# Altium project ELS_CONTROL.PrjPcb
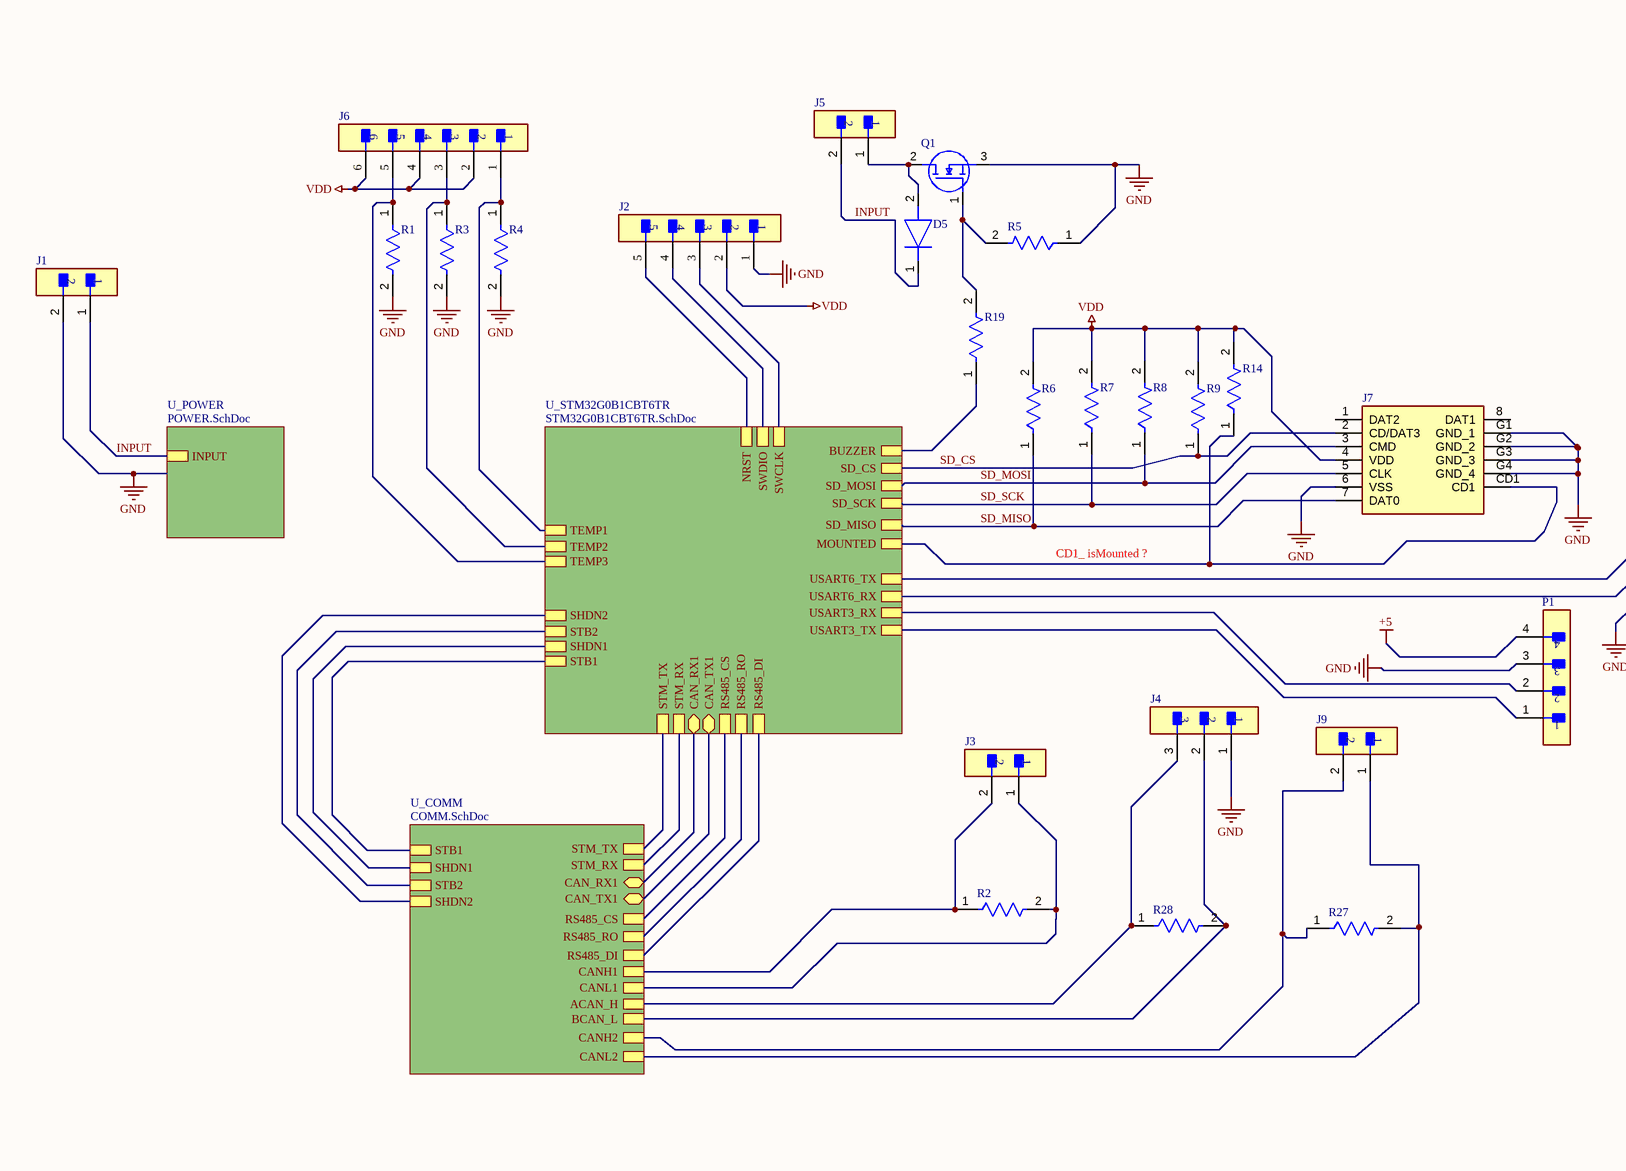
[diagram p0: MAIN.SchDoc, left]
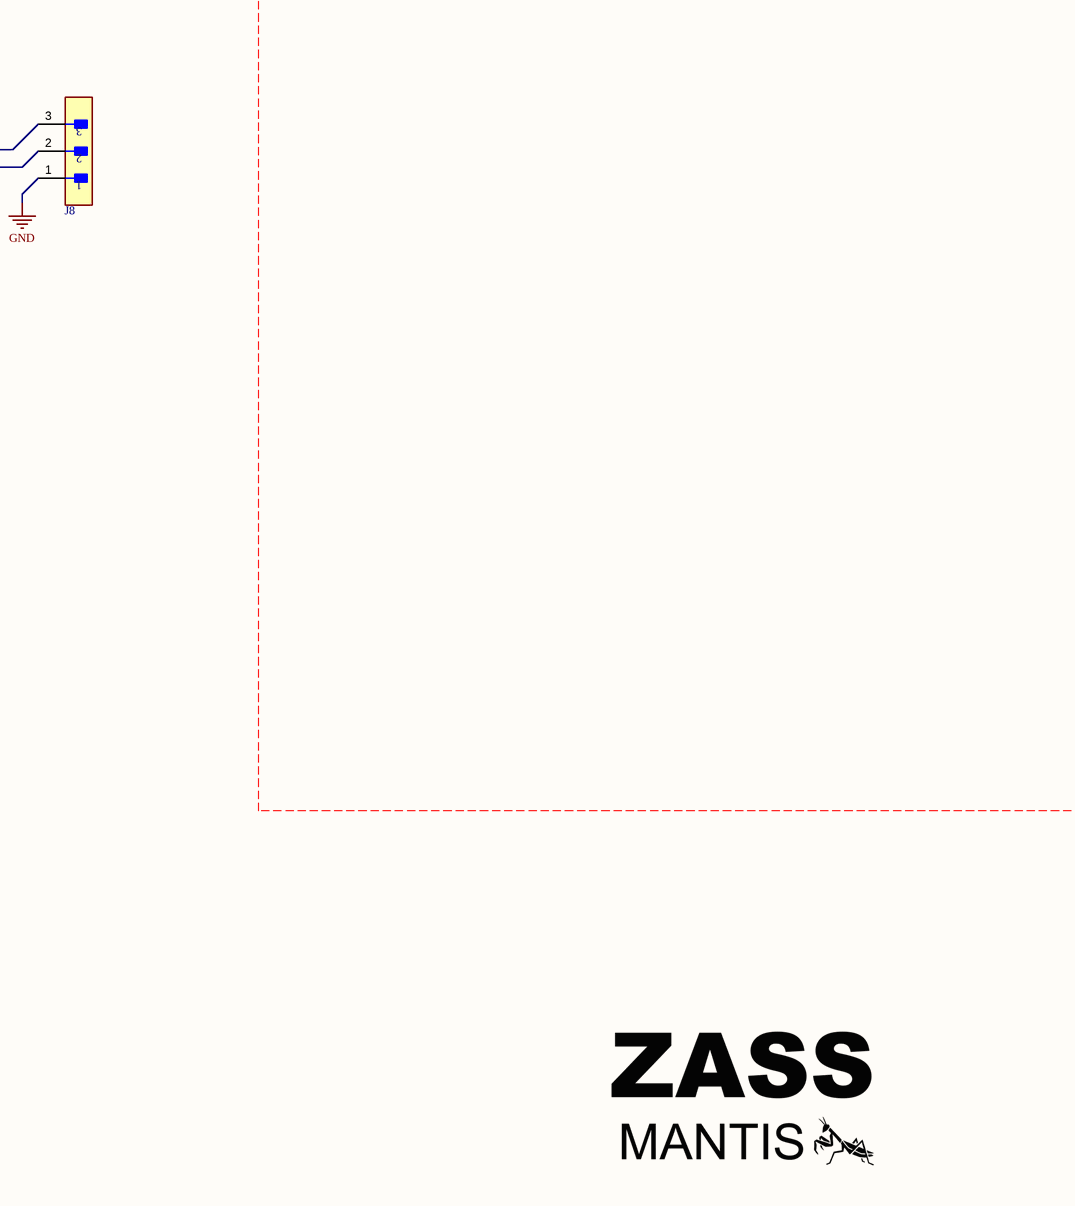
[diagram p1: MAIN.SchDoc, right]
4 sheets, 61 parts. Net scope: hierarchical (ports join the sheet entries above them; power ports are global).
Board files: PCB2.PcbDoc, PCB1.PcbDoc
Sheets:
  MAIN.SchDoc
    U_STM32G0B1CBT6TR = STM32G0B1CBT6TR.SchDoc
    U_POWER = POWER.SchDoc
    U_COMM = COMM.SchDoc

## Sheet MAIN.SchDoc
size 594 x 420 mm; SheetNumber: 1; SheetTotal: 4

### Parts
D5  1N4007WS  [SOD2613X110N]  (value not drawn)
J1  B2B-XH-A(LF)(SN)  [FP-B2B-XH-A_LF_SN-MFG]  (value not drawn)
J2  B5B-XH-AM(LF)(SN)  [FP-B5B-XH-AM_LF_SN-MFG]  (value not drawn)
J3  B2B-XH-A(LF)(SN)  [FP-B2B-XH-A_LF_SN-MFG]  (value not drawn)
J4  B3B-XH-A(LF)(SN)  [FP-B3B-XH-A_LF_SN-MFG]  (value not drawn)
J5  S2B-XH-A(LF)(SN)  [FP-B2B-XH-A_LF_SN-MFG]  (value not drawn)
J6  B6B-XH-AM(LF)(SN)  [FP-B6B-XH-AM_LF_SN-MFG]  (value not drawn)
J7  MSD-4-A  [MSD4A]  (value not drawn)
J8  B3B-XH-A(LF)(SN)  [FP-B3B-XH-A_LF_SN-MFG]  (value not drawn)
J9  B2B-XH-A(LF)(SN)  [FP-B2B-XH-A_LF_SN-MFG]  (value not drawn)
P1  B4B-XH-A(LF)(SN)  [FP-B4B-XH-A_LF_SN-MFG]  (value not drawn)
Q1  AO3422  [SOT95P237X112-3N]  (value not drawn)
R1  CRGCQ0603J10K  [FP-CRGCQ0603-IPC_C]  (value not drawn)
R2  CRGCQ0603F120R  [FP-CRGCQ0603-IPC_C]  (value not drawn)
R3  CRGCQ0603J10K  [FP-CRGCQ0603-IPC_C]  (value not drawn)
R4  CRGCQ0603J10K  [FP-CRGCQ0603-IPC_C]  (value not drawn)
R5  CRGCQ0603J10K  [FP-CRGCQ0603-IPC_C]  (value not drawn)
R6  CRCW06034K70FKEA  [FP-CRCW0603-e3-IPC_A]  (value not drawn)
R7  CRCW06034K70FKEA  [FP-CRCW0603-e3-IPC_A]  (value not drawn)
R8  CRCW06034K70FKEA  [FP-CRCW0603-e3-IPC_A]  (value not drawn)
R9  CRCW06034K70FKEA  [FP-CRCW0603-e3-IPC_A]  (value not drawn)
R14  CRCW06034K70FKEA  [FP-CRCW0603-e3-IPC_A]  (value not drawn)
R19  CRGCQ0603F1K2  [FP-CRGCQ0603-IPC_C]  (value not drawn)
R27  CRGCQ0603F120R  [FP-CRGCQ0603-IPC_C]  (value not drawn)
R28  CRGCQ0603F120R  [FP-CRGCQ0603-IPC_C]  (value not drawn)

### Sub-sheets
U_COMM = COMM.SchDoc: CAN_TX1 (bidir), CAN_RX1 (bidir), ACAN_H, BCAN_L, STM_RX, STM_TX, RS485_CS, CANH1, CANL1, STB1, SHDN1, STB2, SHDN2, CANL2, CANH2, RS485_DI, RS485_RO
U_POWER = POWER.SchDoc: INPUT
U_STM32G0B1CBT6TR = STM32G0B1CBT6TR.SchDoc: CAN_RX1 (bidir), CAN_TX1 (bidir), STM_TX, STM_RX, USART3_RX, USART3_TX, TEMP1, TEMP2, TEMP3, SD_CS, SD_SCK, SD_MISO, SD_MOSI, BUZZER, RS485_CS, NRST, SWCLK, SWDIO, STB1, SHDN1, STB2, SHDN2, MOUNTED, RS485_DI, RS485_RO, USART6_RX, USART6_TX

### Nets
+5: P1.4
GND: J1.2 J2.1 J4.1 J7.6(VSS) J7.G1(GND_1) J7.G2(GND_2) J7.G3(GND_3) J7.G4(GND_4) J8.1 P1.3 Q1.3(S) R1.2 R3.2 R4.2 R5.1
VDD: J2.2 J6.2 J6.4 J6.6 J7.4(VDD) R6.2 R7.2 R8.2 R9.2 R14.2
ACAN_H: J4.3 R28.1 ; sheet U_COMM/ACAN_H
BCAN_L: J4.2 R28.2 ; sheet U_COMM/BCAN_L
INPUT: D5.1(K) J1.1 J5.2 ; sheet U_POWER/INPUT
NRST: J2.5 J6.1 R4.1 ; sheet U_STM32G0B1CBT6TR/TEMP1, sheet U_STM32G0B1CBT6TR/NRST
SD_CS: J7.2(CD/DAT3) R9.1 ; sheet U_STM32G0B1CBT6TR/SD_CS
SD_MISO: J7.7(DAT0) R6.1 ; sheet U_STM32G0B1CBT6TR/SD_MISO
SD_MOSI: J7.3(CMD) R8.1 ; sheet U_STM32G0B1CBT6TR/SD_MOSI
SD_SCK: J7.5(CLK) R7.1 ; sheet U_STM32G0B1CBT6TR/SD_SCK
SHDN1: sheet U_STM32G0B1CBT6TR/SHDN1, sheet U_COMM/SHDN1
SHDN2: sheet U_STM32G0B1CBT6TR/SHDN2, sheet U_COMM/SHDN2
STB1: sheet U_STM32G0B1CBT6TR/STB1, sheet U_COMM/STB1
STB2: sheet U_STM32G0B1CBT6TR/STB2, sheet U_COMM/STB2
SWCLK: J2.3 ; sheet U_STM32G0B1CBT6TR/SWCLK
SWDIO: J2.4 ; sheet U_STM32G0B1CBT6TR/SWDIO
NetD2_1: J3.2 R2.1 ; sheet U_COMM/CANH1
NetD2_2: J3.1 R2.2 ; sheet U_COMM/CANL1
NetD4_1: J9.2 R27.1 ; sheet U_COMM/CANH2
NetD4_2: J9.1 R27.2 ; sheet U_COMM/CANL2
NetD5_2: D5.2(A) J5.1 Q1.2(D)
NetIC1_12: J6.3 R3.1 ; sheet U_STM32G0B1CBT6TR/TEMP2
NetIC1_13: J6.5 R1.1 ; sheet U_STM32G0B1CBT6TR/TEMP3
NetIC1_14: J7.CD1 R14.1 ; sheet U_STM32G0B1CBT6TR/MOUNTED
NetIC1_19: sheet U_STM32G0B1CBT6TR/STM_RX, sheet U_COMM/STM_RX
NetIC1_20: sheet U_STM32G0B1CBT6TR/STM_TX, sheet U_COMM/STM_TX
NetIC1_22: P1.1 ; sheet U_STM32G0B1CBT6TR/USART3_TX
NetIC1_23: P1.2 ; sheet U_STM32G0B1CBT6TR/USART3_RX
NetIC1_29: sheet U_STM32G0B1CBT6TR/RS485_CS, sheet U_COMM/RS485_CS
NetIC1_32: R19.1 ; sheet U_STM32G0B1CBT6TR/BUZZER
NetIC1_33: sheet U_STM32G0B1CBT6TR/CAN_RX1, sheet U_COMM/CAN_RX1
NetIC1_34: sheet U_STM32G0B1CBT6TR/CAN_TX1, sheet U_COMM/CAN_TX1
NetIC1_40: sheet U_STM32G0B1CBT6TR/RS485_DI, sheet U_COMM/RS485_DI
NetIC1_41: sheet U_STM32G0B1CBT6TR/RS485_RO, sheet U_COMM/RS485_RO
NetIC1_47: J8.2 ; sheet U_STM32G0B1CBT6TR/USART6_RX
NetIC1_48: J8.3 ; sheet U_STM32G0B1CBT6TR/USART6_TX
NetQ1_1: Q1.1(G) R5.2 R19.2

Not connected (* = marked no-connect by the designer): J7 1(DAT2) 8(DAT1)

### Notes on the sheet
- CD1_ isMounted ?
- DWG NO:
- REV:
- THIS DOCUMENT AND THE DATA DISCLOSED HEREIN OR
- HEREWITH IS THE PROPERTY OF ALTIUM LIMITED AND MAY
- BE FREELY DISTRIBUTED IN WHOLE. NO RIGHTS ARE
- RESERVED OR EXPRESS OR IMPLIED WARANTEE GIVEN.
- REVISION
- DESCRIPTION
- DATE
- APPROVED
- PROJECT
- PROJECT REVISION:
- TITLE
- A2
- SIZE
- FILE NAME
- SHEET
- OF

### Library data of the parts
D5 = 1N4007WS: Diode; Manufacturer_Name: MDD; Datasheet Link: https://datasheet.lcsc.com/szlcsc/MDD-Jiangsu-Yutai-Elec-1N4007WS_C193404.pdf; Height: 1.1mm; Manufacturer_Part_Number: 1N4007WS
J1 J3 J5 J9 = CMP-2000-05888-3: CONN HEADER VERT 2POS 2.5MM; Current Rating: 3A; Voltage Rating: 250V; Number of Contacts: 2; Contact Resistance: 20mR; Wire/Cable Gauge: 22AWG; Insulation Resistance: 1GR; Connector Type: Male Pin; Packaging: Bulk; Contact Material: Brass; Lead Free: Lead Free; Orientation: Straight; Contact Plating: Tin; Max Current Rating: 3A; Termination: Solder; Fastening Type: Detent; Depth: 5.75mm; Housing Material: Polyamide; REACH SVHC: No SVHC; Series: XH; Voltage Rating (AC): 250V; Number of Positions: 2; Color: Natural; Contact Type: Male Pin; Max Voltage Rating (DC): 250V; Pitch: 2.5mm; Lead Pitch: 2.5mm; Mount: Through Hole; Max Operating Temperature: 85°C; Length: 7.4mm; Max Voltage Rating (AC): 250V; Min Operating Temperature: -25°C; Number of Rows: 1; Housing Color: White
J2 = CMP-17439-000304-1: CONN HEADER VERT 5POS 2.5MM; Mated Stacking Heights: 9.8mm; Voltage Rating: 250V; Max Current Rating: 3A; Number of Positions: 5; Contact Resistance: 20mR; Depth: 5.75mm; Connector Type: Header; Color: Green; Insulation Material: Nylon; Contact Plating: Copper; Length: 14.9mm; Fastening Type: Detent; Contact Material: Brass; Number of Rows: 1; Contact Type: Male Pin; Housing Material: Polyamide; Housing Color: White; Lead Free: Lead Free; Max Voltage Rating (AC): 250V; Mount: Through Hole; Contact Shape: Square; Min Operating Temperature: -25°C; Packaging: Bulk; Orientation: Straight; Insulation Color: Natural; Series: XH; Flammability Rating: UL94 V-0; Contact Finish - Mating: TIN; Max Operating Temperature: 85°C; Termination: Solder; Pitch: 2.5mm
J4 J8 = CMP-17439-000014-3: CONN HEADER VERT 3POS 2.5MM; Max Voltage Rating (DC): 250V; Number of Positions: 3; Current Rating: 3A; Gender: Male; Wire/Cable Gauge: 22AWG; Contact Resistance: 20mR; Insulation Resistance: 1GR; Insulation Material: Nylon; Contact Plating: Tin; Depth: 5.75mm; Contact Type: Male Pin; Max Operating Temperature: 85°C; Insulation Color: Natural; Voltage Rating (AC): 250V; Color: Natural; Connector Type: Header; Orientation: Straight; Fastening Type: Detent; Housing Color: White; Min Operating Temperature: -25°C; Termination: Solder; Voltage Rating: 250V; Series: XH; Pitch: 2.5mm; Contact Shape: Square; Number of Rows: 1; Lead Free: Lead Free; Packaging: Bulk; Mount: Through Hole; Flammability Rating: UL94 V-0; Max Voltage Rating (AC): 250V; REACH SVHC: No SVHC; Housing Material: Polyamide; Contact Material: Brass; Lead Pitch: 2.5mm; Contact Finish - Mating: TIN; Length: 9.9mm; Max Current Rating: 3A; Number of Contacts: 3
J6 = CMP-17439-000167-1: CONN HEADER VERT 6POS 2.5MM; Shape: Straight; Current Rating: 3A; Mated Stacking Heights: 9.8mm; Number of Positions: 6; Voltage Rating: 250V; Pitch: 2.5mm; Insulation Color: Natural; Number of Pins: 6; Width: 5.75mm; Flammability Rating: UL94 V-0; Packaging: Bulk; Connector Type: Header; Number of Rows: 1; Contact Plating: Copper; Mount: Through Hole; Min Operating Temperature: -25°C; Contact Type: Male Pin; Contact Shape: Square; Fastening Type: Detent; Length: 17.4mm; Series: XH; Contact Finish - Mating: TIN; Max Operating Temperature: 85°C; Insulation Material: Nylon; Number of Poles: 6; Termination: Press-Fit; Contact Material: Brass; Height: 7mm
J7 = MSD-4-A: Connector; Manufacturer_Name: Same Sky; Datasheet Link: https://www.sameskydevices.com/product/resource/MSD-4-A.pdf; Height: 2mm; Manufacturer_Part_Number: MSD-4-A; Mouser Part Number: 179-MSD-4-A; Mouser Price/Stock: https://www.mouser.co.uk/ProductDetail/Same-Sky/MSD-4-A?qs=Z%252BL2brAPG1Jll%252BQTi%252Btupg%3D%3D; Arrow Part Number: MSD-4-A; Arrow Price/Stock: https://www.arrow.com/en/products/msd-4-a/cui-devices?utm_currency=USD&region=nac
P1 = CMP-17439-000250-1: CONN HEADER VERT 4POS 2.5MM; Number of Contacts: 4; Contact Resistance: 20mR; Voltage Rating: 250V; Max Current Rating: 3A; Gender: Male; Wire/Cable Gauge: 22AWG; Mated Stacking Heights: 9.8mm; Insulation Resistance: 1GR; Orientation: Straight; Contact Type: Male Pin; Contact Finish - Mating: TIN; Series: XH; Max Voltage Rating (AC): 250V; Lead Pitch: 2.5mm; Contact Shape: Square; Insulation Color: Natural; Termination: Solder; Lead Free: Lead Free; Voltage Rating (AC): 250V; Number of Rows: 1; Flammability Rating: UL94 V-0; Number of Positions: 4; Max Operating Temperature: 85°C; Package Quantity: 500; Mount: Through Hole; REACH SVHC: No SVHC; Connector Type: Header; Insulation Material: Nylon; Fastening Type: Detent; Min Operating Temperature: -25°C; Housing Color: White; Packaging: Bulk; Contact Plating: Tin; Contact Material: Brass; Max Voltage Rating (DC): 250V; Housing Material: Polyamide; Color: Natural; Material: Polyamide; Pitch: 2.5mm; Depth: 5.75mm; Current Rating: 3A; Length: 12.4mm
Q1 = AO3422: MOSFET (N-Channel); Manufacturer_Name: Alpha & Omega Semiconductors; Datasheet Link: http://aosmd.com/res/data_sheets/AO3422.pdf; Height: 1.12mm; Manufacturer_Part_Number: AO3422; Arrow Part Number: AO3422; Arrow Price/Stock: https://www.arrow.com/en/products/ao3422/alpha-and-omega-semiconductor?region=nac
R1 R3-R5 = CMP-03211-009884-1: CRGCQ 0603 10K 5%; Manufacturer: TE Connectivity; Tolerance: 0.05; Power Rating: 0.1W; Resistance: 10KΩ; Voltage Rating: 75V; Value: 10KΩ; Temperature Coefficient: ±100ppm/°C; Composition: Thick Film; ComponentLink2URL: https://www.te.com/commerce/DocumentDelivery/DDEController?Action=showdoc&DocId=Data+Sheet%7F1773204-3%7F1%7Fpdf%7FEnglish%7FENG_DS_1773204-3_1.pdf%7F4-2176339-923; Device Class L1: Passive Components; Package: CRGCQ0603; Mouser Description: Res Thick Film 0603 10K Ohm 5% 0.1W(1/10W) ±100ppm/C Pad SMD Automotive T/R; Temperature Range High: +155°C; Category: Res; Device Class L2: Resistors; Height: 0.55mm; RoHS: TRUE; Lead Free: Yes; Ipc Land Pattern Name: RESC16080X45; Temperature: -55°C to +155°C; Series: CRGCQ; Digikey Description: CRGCQ 0603 10K 5%; Octopart: https://octopart.com/crgcq0603j10k-te+connectivity-91018097; Device Class L3: Chip SMD Resistors; Ambient Temperature Range High: +70°C; ComponentLink2Description: Datasheet; Temperature Range Low: -55°C; Manufacturer Part Number: CRGCQ0603J10K
R2 R27 R28 = CMP-03211-001601-1: CRGCQ0603 120Ω 1% ±100ppm/°C 75V; Manufacturer: TE Connectivity; Tolerance: 0.01; Power Rating: 0.1W; Voltage Rating: 75V; Device Class L2: Resistors; Ambient Temperature Range High: +70°C; Mouser Description: Res, Aec-Q200, Thick Film, 120R, 1%, 0603; Composition: Thick Film; Device Class L1: Passive Components; Temperature Range Low: -55°C; Manufacturer Part Number: CRGCQ0603F120R; Lead Free: Yes; Value: 120Ω; ComponentLink2Description: Datasheet; Device Class L3: Chip SMD Resistors; Package: CRGCQ0603; Ipc Land Pattern Name: RESC16080X45; Height: 0.55mm; Category: Res; RoHS: TRUE; Temperature Range High: +155°C; Resistance: 120Ω; Octopart: https://octopart.com/crgcq0603f120r-te+connectivity-91018039; Temperature Coefficient: ±100ppm/°C; ComponentLink2URL: https://www.te.com/commerce/DocumentDelivery/DDEController?Action=showdoc&DocId=Data+Sheet%7F1773204-3%7F1%7Fpdf%7FEnglish%7FENG_DS_1773204-3_1.pdf%7F4-2176339-482; Temperature: -55°C to +155°C; Series: CRGCQ
R6-R9 R14 = CMP-1666-00019-3: RES Thick Film, 4.7kΩ, 1%, 0.1W, 100ppm/°C, 0603; Resistance: 4.7kR; Voltage Rating: 75V; Power Rating: 100mW; Case Code (Metric): 1608; Military Standard: Not; Packaging: Tape and Reel; Termination: SMD/SMT; Temperature Coefficient: 100ppm/°C; Lead Free: Lead Free; Length: 1.55mm; Width: 0.85mm; Height: 0.45mm; Depth: 0.85mm; Weight: 7.1E-05oz; Case Code (Imperial): 0603; Contact Plating: Tin; Case/Package: 0603; Max Operating Temperature: 155°C; Mount: Surface Mount; Tolerance: 1%; Min Operating Temperature: -55°C; Package Quantity: 5000; Voltage Rating (DC): 75V; Composition: Thick Film
R19 = CMP-03211-000516-1: CRGCQ 0603 1K2 1%; Manufacturer: TE Connectivity; Power Rating: 0.1W; Resistance: 1.2KΩ; Value: 1.2KΩ; Voltage Rating: 75V; Temperature Coefficient: ±100ppm/°C; Tolerance: 0.01; Octopart: https://octopart.com/crgcq0603f1k2-te+connectivity-91018051; ComponentLink2Description: Datasheet; ComponentLink2URL: https://www.te.com/commerce/DocumentDelivery/DDEController?Action=showdoc&DocId=Data+Sheet%7F1773204-3%7F1%7Fpdf%7FEnglish%7FENG_DS_1773204-3_1.pdf%7F4-2176339-710; Category: Res; Temperature: -55°C to +155°C; Temperature Range High: +155°C; Ipc Land Pattern Name: RESC16080X45; Device Class L2: Resistors; Height: 0.55mm; Ambient Temperature Range High: +70°C; RoHS: TRUE; Package: CRGCQ0603; Temperature Range Low: -55°C; Digikey Description: CRGCQ 0603 1K2 1%; Series: CRGCQ; Lead Free: Yes; Manufacturer Part Number: CRGCQ0603F1K2; Device Class L1: Passive Components; Composition: Thick Film; Device Class L3: Chip SMD Resistors

## Sheet STM32G0B1CBT6TR.SchDoc
size 594 x 420 mm; SheetNumber: 2; SheetTotal: 4
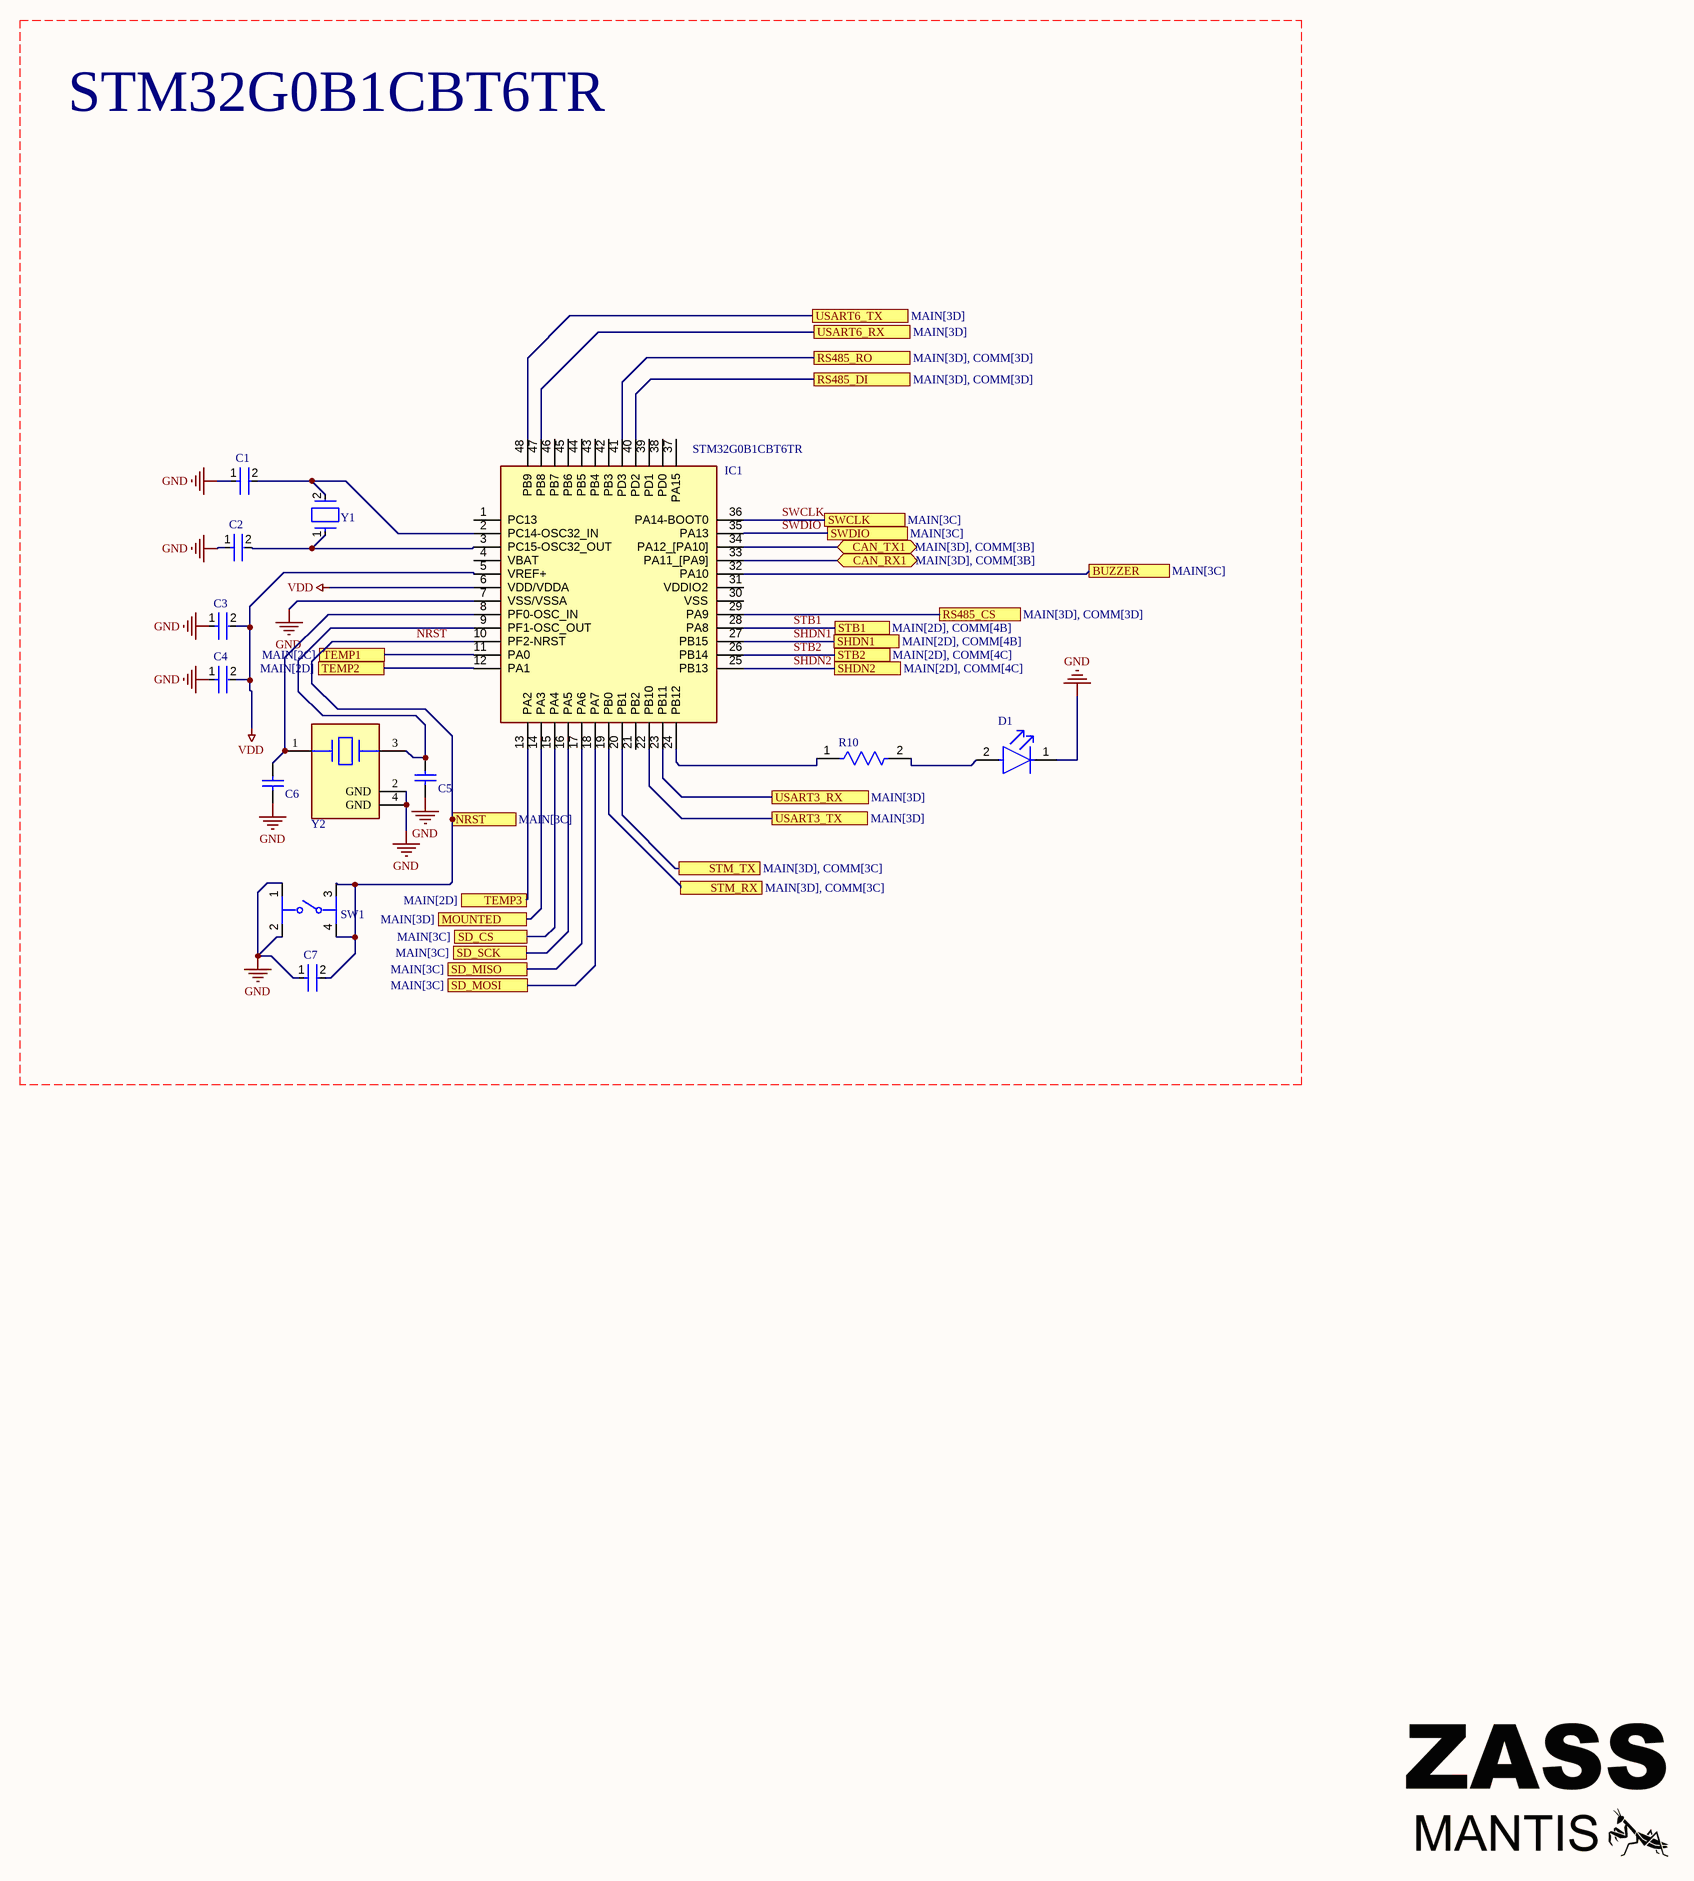
[diagram p2: STM32G0B1CBT6TR.SchDoc]

### Parts
C1  C0805C519D3HACTU  [FP-C0805C-DN-MFG]  (value not drawn)
C2  C0805C519D3HACTU  [FP-C0805C-DN-MFG]  (value not drawn)
C3  C0805C104K5RACTU  [FP-C0805C-DN-MFG]  (value not drawn)
C4  C0805C104K5RACTU  [FP-C0805C-DN-MFG]  (value not drawn)
C5  GRM1885C1H100JA01D  [CAPC1608X90X35LL10T15]  (value not drawn)
C6  GRM1885C1H100JA01D  [CAPC1608X90X35LL10T15]  (value not drawn)
C7  C0805C104K5RACTU  [FP-C0805C-DN-MFG]  (value not drawn)
D1  LTST-C230EKT  [FP-LTST-C230EKT-MFG]  (value not drawn)
IC1  STM32G0B1CBT6TR  [QFP50P900X900X160-48N]
R10  CRGCQ1206F1K0  [FP-CRGCQ1206-IPC_C]  (value not drawn)
SW1  PTS647SK38SMTR2LFS  [FP-PTS647SK38SMTR2LFS-MFG]  (value not drawn)
Y1  ABS06-32.768KHZ-9-1-T  [FP-ABS06-MFG]  (value not drawn)
Y2  ABM8G-24.000MHZ-B4Y-T  [FP-ABM8G-MFG]  (value not drawn)

### Ports
BUZZER (see MAIN[3C]), CAN_RX1 (bidir, see MAIN[3D], COMM[3B]), CAN_TX1 (bidir, see MAIN[3D], COMM[3B]), MOUNTED (see MAIN[3D]), NRST (see MAIN[3C]), RS485_CS (see MAIN[3D], COMM[3D]), RS485_DI (see MAIN[3D], COMM[3D]), RS485_RO (see MAIN[3D], COMM[3D]), SD_CS (see MAIN[3C]), SD_MISO (see MAIN[3C]), SD_MOSI (see MAIN[3C]), SD_SCK (see MAIN[3C]), SHDN1 (see MAIN[2D], COMM[4B]), SHDN2 (see MAIN[2D], COMM[4C]), STB1 (see MAIN[2D], COMM[4B]), STB2 (see MAIN[2D], COMM[4C]), STM_RX (see MAIN[3D], COMM[3C]), STM_TX (see MAIN[3D], COMM[3C]), SWCLK (see MAIN[3C]), SWDIO (see MAIN[3C]), TEMP1 (see MAIN[2C]), TEMP2 (see MAIN[2D]), TEMP3 (see MAIN[2D]), USART3_RX (see MAIN[3D]), USART3_TX (see MAIN[3D]), USART6_RX (see MAIN[3D]), USART6_TX (see MAIN[3D])

### Nets
GND: C1.1 C2.1 C3.1 C4.1 C5.1 C6.1 C7.1 D1.1(C) IC1.7(VSS/VSSA) SW1.1 SW1.2 Y2.2(GND) Y2.4(GND)
VDD: C3.2 C4.2 IC1.5(VREF+) IC1.6(VDD/VDDA)
NRST: C7.2 IC1.10(PF2-NRST) IC1.11(PA0) SW1.3 SW1.4 ; port TEMP1, port NRST
SD_CS: IC1.15(PA4) ; port SD_CS
SD_MISO: IC1.17(PA6) ; port SD_MISO
SD_MOSI: IC1.18(PA7) ; port SD_MOSI
SD_SCK: IC1.16(PA5) ; port SD_SCK
SHDN1: IC1.27(PB15) ; port SHDN1
SHDN2: IC1.25(PB13) ; port SHDN2
STB1: IC1.28(PA8) ; port STB1
STB2: IC1.26(PB14) ; port STB2
SWCLK: IC1.36(PA14-BOOT0) ; port SWCLK
SWDIO: IC1.35(PA13) ; port SWDIO
NetC1_2: C1.2 IC1.2(PC14-OSC32_IN) Y1.2
NetC2_2: C2.2 IC1.3(PC15-OSC32_OUT) Y1.1
NetC5_2: C5.2 IC1.9(PF1-OSC_OUT) Y2.3
NetC6_2: C6.2 IC1.8(PF0-OSC_IN) Y2.1
NetD1_2: D1.2(A) R10.2
NetIC1_12: IC1.12(PA1) ; port TEMP2
NetIC1_13: IC1.13(PA2) ; port TEMP3
NetIC1_14: IC1.14(PA3) ; port MOUNTED
NetIC1_19: IC1.19(PB0) ; port STM_RX
NetIC1_20: IC1.20(PB1) ; port STM_TX
NetIC1_22: IC1.22(PB10) ; port USART3_TX
NetIC1_23: IC1.23(PB11) ; port USART3_RX
NetIC1_24: IC1.24(PB12) R10.1
NetIC1_29: IC1.29(PA9) ; port RS485_CS
NetIC1_32: IC1.32(PA10) ; port BUZZER
NetIC1_33: IC1.33(PA11_[PA9]) ; port CAN_RX1
NetIC1_34: IC1.34(PA12_[PA10]) ; port CAN_TX1
NetIC1_40: IC1.40(PD2) ; port RS485_DI
NetIC1_41: IC1.41(PD3) ; port RS485_RO
NetIC1_47: IC1.47(PB8) ; port USART6_RX
NetIC1_48: IC1.48(PB9) ; port USART6_TX

Not connected (* = marked no-connect by the designer): IC1 1(PC13) 4(VBAT) 21(PB2) 30(VSS) 31(VDDIO2) 37(PA15) 38(PD0) 39(PD1) 42(PB3) 43(PB4) 44(PB5) 45(PB6) 46(PB7)

### Notes on the sheet
- STM32G0B1CBT6TR
- DWG NO:
- REV:
- THIS DOCUMENT AND THE DATA DISCLOSED HEREIN OR
- HEREWITH IS THE PROPERTY OF ALTIUM LIMITED AND MAY
- BE FREELY DISTRIBUTED IN WHOLE. NO RIGHTS ARE
- RESERVED OR EXPRESS OR IMPLIED WARANTEE GIVEN.
- REVISION
- DESCRIPTION
- DATE
- APPROVED
- PROJECT
- PROJECT REVISION:
- TITLE
- A2
- SIZE
- FILE NAME
- SHEET
- OF

### Library data of the parts
C1 C2 = CMP-03020-033346-1: C0805 5.1 pF X8R 30ppm/°C 0.5 pF 25 V; Manufacturer: KEMET; Voltage Rating: 25 V; Tolerance: 0.5 pF; Capacitance: 5.1 pF; Value: 5.1 pF; Material: Ceramic; Category: Cap; Lead Free: Yes; Temperature Characteristic: X8R; Manufacturer Part Number: C0805C519D3HACTU; Ipc Land Pattern Name: CAPC200125X78; ComponentLink2Description: Datasheet; Package: C0805C-DN; Device Class L2: Capacitors; Automotive: No; Octopart: https://octopart.com/c0805c519d3hactu-kemet-88727353; Device Class L1: Passive Components; Temperature Coefficient: 30ppm/°C; Temperature Range High: +125°C; Height: 0.88mm; Temperature Range Low: -55°C; ComponentLink2URL: https://content.kemet.com/datasheets/KEM_C1003_C0G_SMD.pdf; Device Class L3: Ceramic Capacitors; RoHS: TRUE; Temperature: -55°C to +125°C
C3 C4 C7 = CMP-2007-00279-2: CAP CER 0.1UF 50V X7R 0805; Manufacturer: KEMET; Value: 0.10 μF; Tolerance: 0.1; Temperature Coefficient: 30ppm/°C; Material: Ceramic; Manufacturer Part Number: C0805C104K5RACTU; Device Class L2: Capacitors; Temperature Range Low: -55°C; Voltage Rating: 50 V; Digikey Description: CAP CER 0.1UF 50V X7R 0805; Category: Cap; ComponentLink2Description: Datasheet; Octopart: https://octopart.com/c0805c104k5ractu-kemet-143926; RoHS: TRUE; ComponentLink2URL: https://content.kemet.com/datasheets/KEM_C1003_C0G_SMD.pdf; Temperature Characteristic: X7R; Temperature: -55°C to +125°C; Height: 0.88mm; Temperature Range High: +125°C; Device Class L1: Passive Components; Automotive: No; Lead Free: Yes; Ipc Land Pattern Name: CAPC200125X78; Device Class L3: Ceramic Capacitors; Mouser Description: Cap Ceramic 0.1uF 50V X7R 10% SMD 2.0 x 1.2 mm 125 C Paper T/R; Capacitance: 0.10 μF; Package: C0805C-DN
C5 C6 = CMP-2006-02592-1: Manufacturer: Murata; Part Number: GRM1885C1H100JA01D
D1 = CMP-22017-000030-1: LED RED CLEAR CHIP SMD; Forward Current: 30mA; Test Current: 10mA; Number of Elements: 1; Viewing Angle: 130°; Dominant Wavelength: 621nm; Forward Voltage: 2V; Lens Style: Diffused; Power Rating: 100mW; Reverse Voltage: 5V; Wavelength: 630nm; Luminous Intensity: 6mcd; Lens Color: Colorless; Case/Package: 1206; Case Code (Imperial): 1206; Package Quantity: 1; Lead Free: Lead Free; Case Code (Metric): 3216; Height: 1.1mm; Lens Transparency: Clear; Mount: Surface Mount; Depth: 1.6mm; Number of LEDs: 1; Power Dissipation: 100mW; Max Operating Temperature: 85°C; Width: 1.6mm; Color: Red; Number of Pins: 2; Min Operating Temperature: -55°C; Packaging: Tape and Reel; Radiation Hardening: No; Illumination Color: Red; Length: 3.2mm
IC1 = STM32G0B1CBT6TR: Integrated Circuit; Manufacturer_Name: STMicroelectronics; Datasheet Link: https://www.st.com/resource/en/datasheet/stm32g0b1cc.pdf; Height: 1.6mm; Manufacturer_Part_Number: STM32G0B1CBT6TR; Mouser Part Number: 511-STM32G0B1CBT6TR; Mouser Price/Stock: https://www.mouser.co.uk/ProductDetail/STMicroelectronics/STM32G0B1CBT6TR?qs=HoCaDK9Nz5cqFCA6TLpp%252Bw%3D%3D; Arrow Part Number: STM32G0B1CBT6TR; Arrow Price/Stock: https://www.arrow.com/en/products/stm32g0b1cbt6tr/stmicroelectronics?utm_currency=USD&region=nac
R10 = CMP-03211-006592-1: CRGCQ1206 1KΩ 0.25W 1% ±100ppm/°C 200V; Manufacturer: TE Connectivity; Automotive Grade: Grade 685; Tolerance: 0.01; Ipc Land Pattern Name: RESC310155X55; Temperature Range Low: -55°C; Device Class L3: Chip SMD Resistors; ComponentLink2URL: https://www.te.com/commerce/DocumentDelivery/DDEController?Action=showdoc&DocId=Data+Sheet%7F1773204-3%7F1%7Fpdf%7FEnglish%7FENG_DS_1773204-3_1.pdf%7F4-2176347-694; Automotive: Yes; Temperature: -55°C to +155°C; Manufacturer Part Number: CRGCQ1206F1K0; Package: CRGCQ1206; Octopart: https://octopart.com/crgcq1206f1k0-te+connectivity-91018258; Device Class L1: Passive Components; Series: CRGCQ; Device Class L2: Resistors; RoHS: TRUE; Lead Free: Yes; ComponentLink2Description: Datasheet; Power Rating: 0.25W; Temperature Coefficient: ±100ppm/°C; Value: 1KΩ; Voltage Rating: 200V; Temperature Range High: +155°C; Height: 0.65mm; Category: Res; Resistance: 1KΩ; Composition: Thick Film; Ambient Temperature Range High: +70°C
SW1 = CMP-10040-000033-1: TACT 4.5 X 4.5, 3.8 MM H, 2.5N,; Switch Function: Off-Mom; Switch Travel: 0.25mm; Actuator Type: Standard; Illumination Type: Non-Illuminated; Mechanical Life: 100000Cycles; Ratings: IP40; Operating Force: 250gf; Throw Configuration: SPST; Max Operating Temperature: 70°C; Min Operating Temperature: -20°C; Termination: Gull Wing; Mount: Surface Mount; Packaging: Tape and Reel
Y1 = CMP-27762-003430-2: Crystal 32.768kHz ±10ppm (Tol) 9pF FUND 90kΩ 2-Pin Mini-CSMD T/R; Series Resistance: 90kR; Series: ABS06; Case/Package: CSMD; Package Quantity: 3000; Load Capacitance: 9pF; Number of Pins: 2; Tolerance: 10ppm; RoHS Compliant: Yes; Depth: 1.2mm; Termination: SMD/SMT; Min Operating Temperature: -40°C; Length: 2mm; Packaging: Tape and Reel; Max Operating Temperature: 85°C; Frequency Tolerance: 10ppm; Width: 1.2mm; ESR (Equivalent Series Resistance): 90kR; Radiation Hardening: No; Frequency: 32.768kHz; REACH SVHC: No SVHC; Mount: Surface Mount; Height: 0.6mm
Y2 = CMP-27762-015229-1: Crystal 24MHz ±30ppm (Tol) ±30ppm (Stability) 10pF FUND 60Ω 4-Pin SMD T/R; Series Resistance: 60R; Width: 2.5mm; Case/Package: CSMD; Load Capacitance: 10pF; Max Operating Temperature: 70°C; Depth: 2.5mm; Min Operating Temperature: -20°C; Frequency Stability: 30ppm; Frequency Tolerance: 30ppm; Frequency: 24MHz; Length: 3.2mm; Height: 1mm; Mount: Surface Mount; Lead Free: Lead Free; Tolerance: 30ppm; ESR (Equivalent Series Resistance): 60R; Number of Pins: 4; Termination: SMD/SMT; Operating Frequency: 24 MHz; Package Quantity: 1000; Series: ABM8G; Packaging: Tape and Reel

## Sheet POWER.SchDoc
size 594 x 420 mm; SheetNumber: 4; SheetTotal: 4
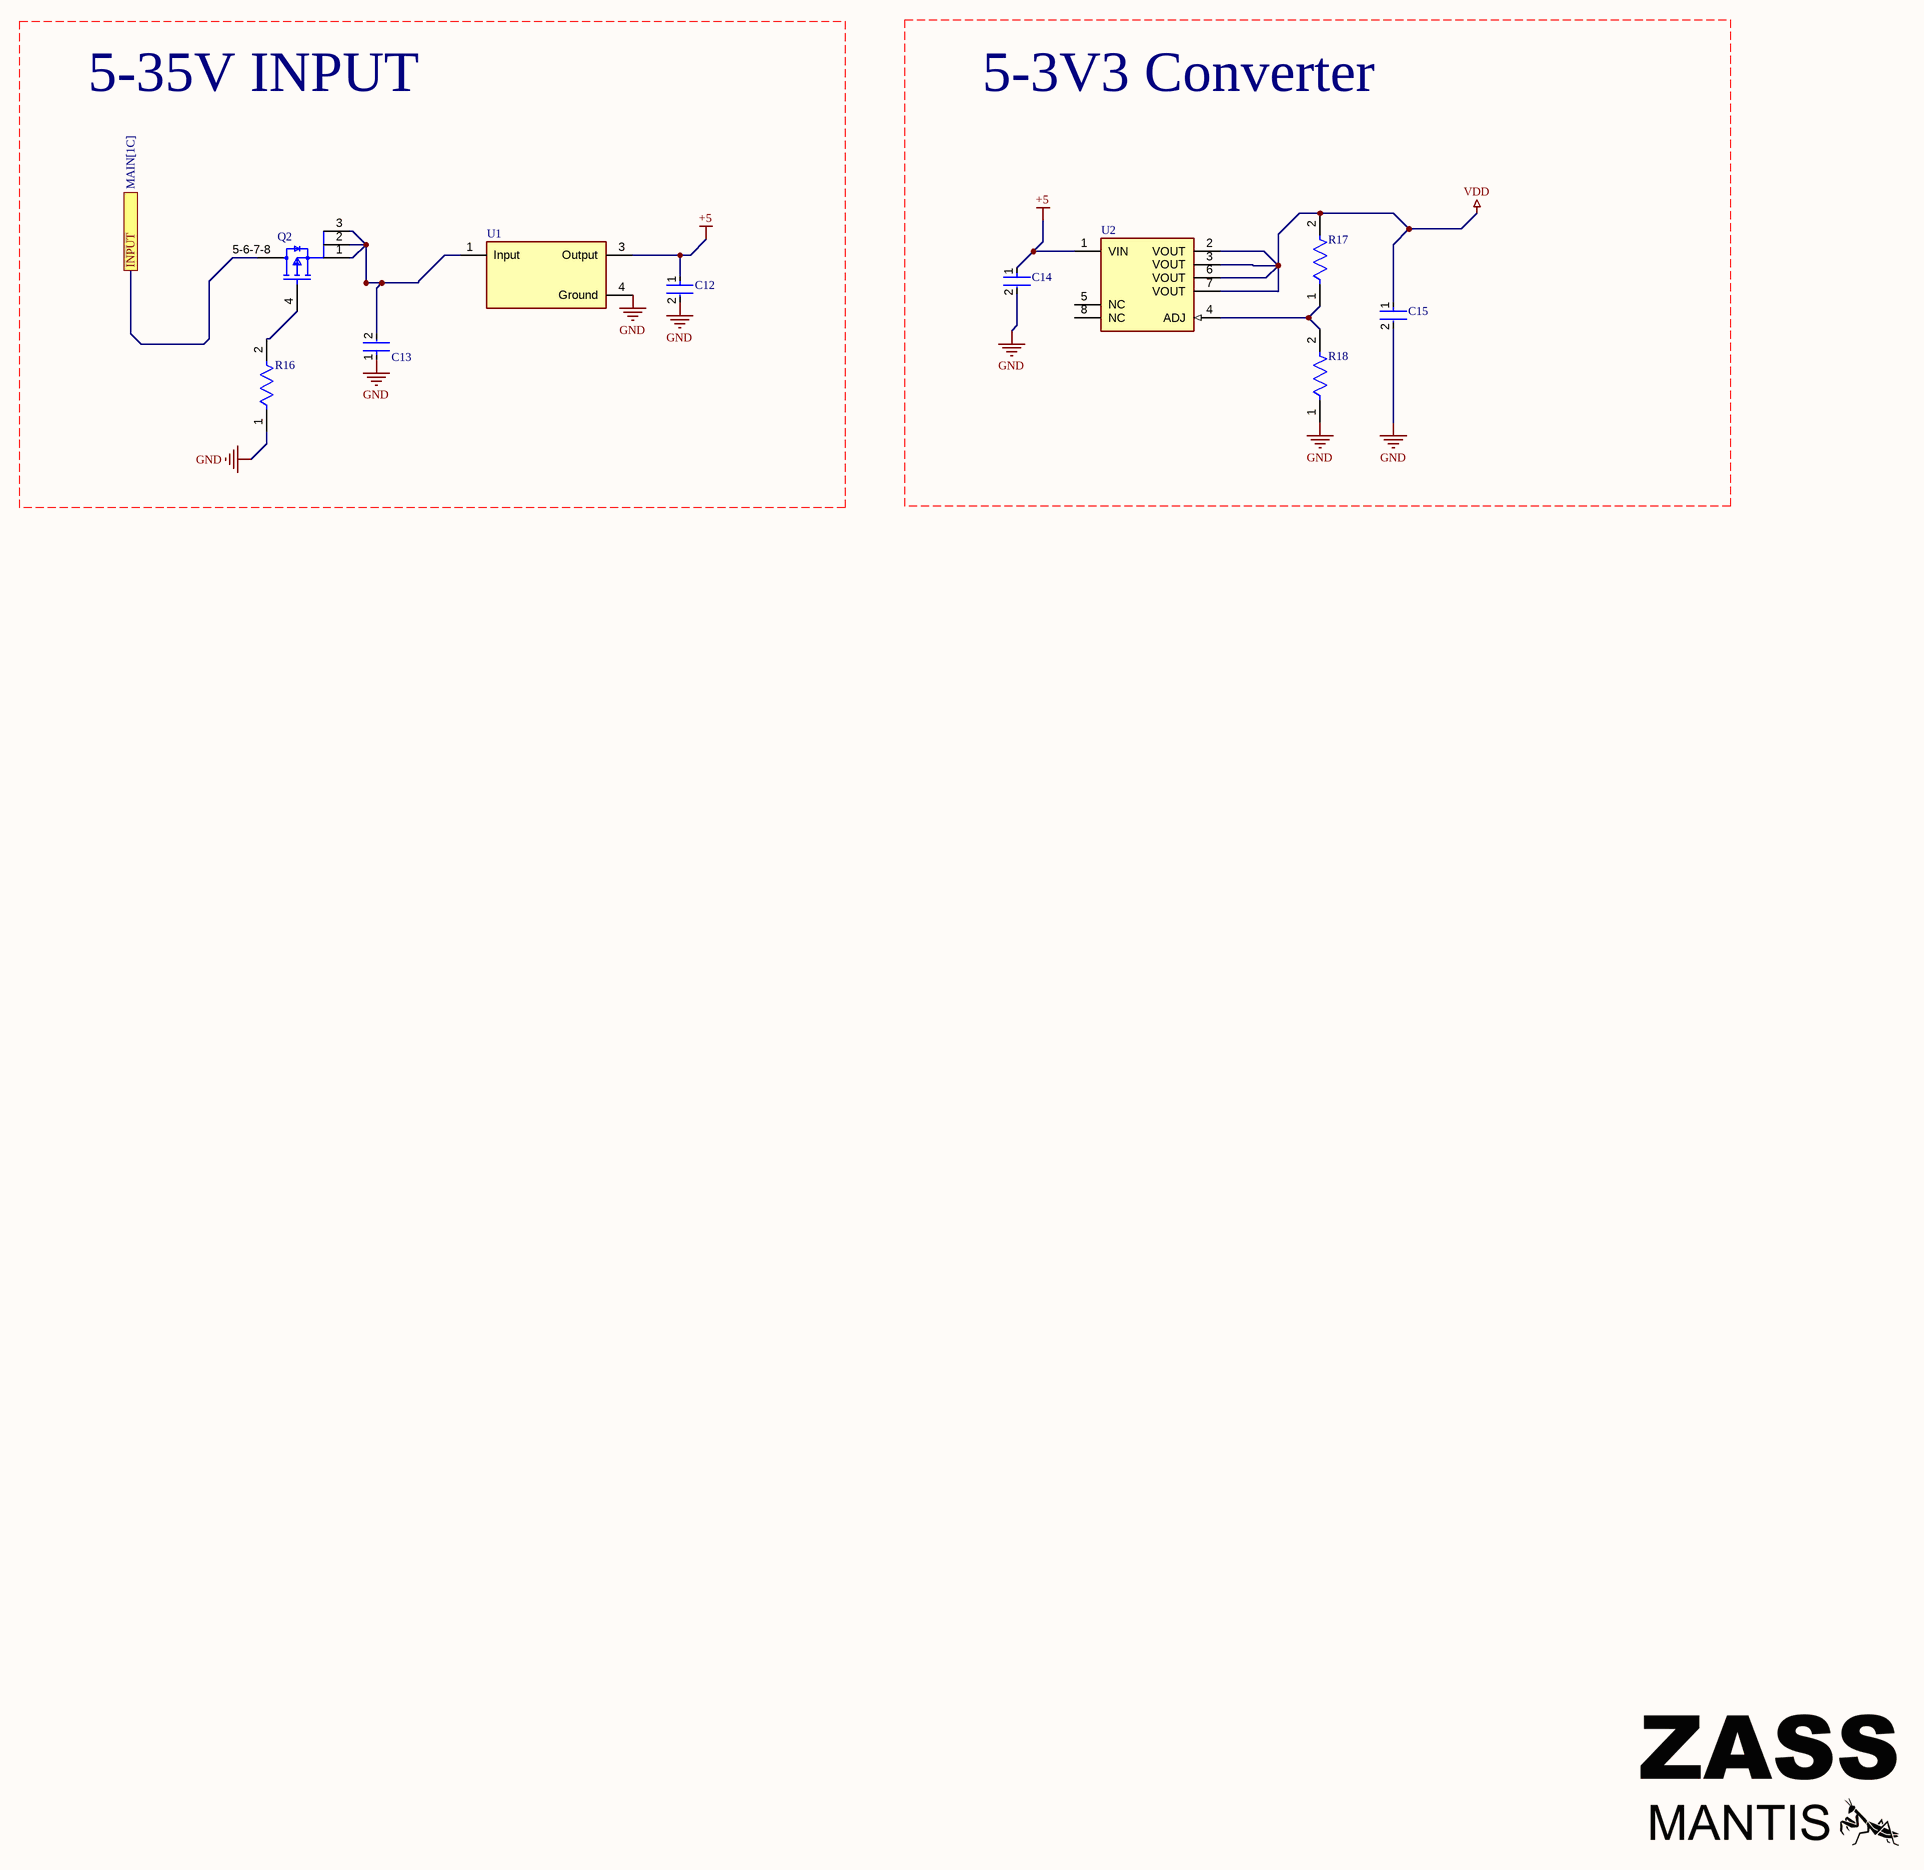
[diagram p3: POWER.SchDoc]

### Parts
C12  CC0805KRX7R5BB104  [FP-CC0805-EA-MFG]  (value not drawn)
C13  C0805C104K5RACTU  [FP-C0805C-DN-MFG]  (value not drawn)
C14  CC0805KRX7R5BB104  [FP-CC0805-EA-MFG]  (value not drawn)
C15  CC0805KRX7R5BB104  [FP-CC0805-EA-MFG]  (value not drawn)
Q2  SI7113ADN-T1-GE3  [FP-S16-2667-SINGLE-MFG]  (value not drawn)
R16  CRGCQ0603F1K2  [FP-CRGCQ0603-IPC_C]  (value not drawn)
R17  CRGCQ0603F1K2  [FP-CRGCQ0603-IPC_C]  (value not drawn)
R18  RC3216J202CS  [FP-RC3216-IPC_A]  (value not drawn)
U1  MC7805CDTRKG  [FP-369C-MFG]  (value not drawn)
U2  LM317LD13TR  [FP-SO-8-0016023-MFG]  (value not drawn)

### Ports
INPUT (see MAIN[1C])

### Nets
+5: C12.1 C14.1 U1.3(Output) U2.1(VIN)
GND: C12.2 C13.1 C14.2 C15.2 R16.1 R18.1 U1.4(Ground)
VDD: C15.1 R17.2 U2.2(VOUT) U2.3(VOUT) U2.6(VOUT) U2.7(VOUT)
INPUT: Q2.5-6-7-8(D) ; port INPUT
NetC13_2: C13.2 Q2.1(S) Q2.2(S) Q2.3(S) U1.1(Input)
NetQ2_4: Q2.4(G) R16.2
NetR17_1: R17.1 R18.2 U2.4(ADJ)

Not connected (* = marked no-connect by the designer): U2 5(NC) 8(NC)

### Notes on the sheet
- 5-35V INPUT
- 5-3V3 Converter
- DWG NO:
- REV:
- THIS DOCUMENT AND THE DATA DISCLOSED HEREIN OR
- HEREWITH IS THE PROPERTY OF ALTIUM LIMITED AND MAY
- BE FREELY DISTRIBUTED IN WHOLE. NO RIGHTS ARE
- RESERVED OR EXPRESS OR IMPLIED WARANTEE GIVEN.
- REVISION
- DESCRIPTION
- DATE
- APPROVED
- PROJECT
- PROJECT REVISION:
- TITLE
- A2
- SIZE
- FILE NAME
- SHEET
- OF

### Library data of the parts
C12 C14 C15 = CMP-03422-000810-2: CAP CER X7R 0805; RoHS Compliant: Yes
C13 = CMP-2007-00279-2: as C3 on sheet STM32G0B1CBT6TR; Manufacturer Part Number: C0805C104K5RACTU; Device Class L2: Capacitors; Temperature Range Low: -55°C; Voltage Rating: 50 V; Digikey Description: CAP CER 0.1UF 50V X7R 0805; Category: Cap; ComponentLink2Description: Datasheet; Octopart: https://octopart.com/c0805c104k5ractu-kemet-143926; RoHS: TRUE; ComponentLink2URL: https://content.kemet.com/datasheets/KEM_C1003_C0G_SMD.pdf; Temperature Characteristic: X7R; Temperature: -55°C to +125°C; Height: 0.88mm; Temperature Range High: +125°C; Device Class L1: Passive Components; Automotive: No; Lead Free: Yes; Ipc Land Pattern Name: CAPC200125X78; Device Class L3: Ceramic Capacitors; Mouser Description: Cap Ceramic 0.1uF 50V X7R 10% SMD 2.0 x 1.2 mm 125 C Paper T/R; Capacitance: 0.10 μF; Package: C0805C-DN
Q2 = CMP-02550-000064-1: MOSFET P-CH 100V 10.8A 1212-8; Manufacturer: Vishay; Pulse Drain Current: -20A; Reverse Recovery Charge: 80nC; Standoff Height: 0mm; Max Junction Temp: +150°C; Max Forward Diode Voltage: -1.2V; Depletion Mode: False; Turn Off Delay Time: 20ns; Drain To Source Resistance: 0.11Ω; Turn On Delay Time: 10ns; Rthja Max: 36°C/W; Gate Charge At Vgs: 10.9nC @ -10V; Transconductance: 8S; Typ Forward Diode Voltage: -0.8V; Threshold Vgs Max: -2.6V; Drain To Source Voltage: -100V; Power Dissipation: 3.5W; Threshold Vgs Min: -1.1V; Input Capacitace At Vds: 515pF @ -50V; Continuous Drain Current: -3.8A; Number Of P Channels: 1; Reverse Recovery Time: 43ns; Gate To Source Voltage: 20V; Automotive: No; Lead Free: Yes; Temperature Range Low: -55°C; Device Class L1: Discrete Semiconductors; Temperature: -55°C to +150°C; ComponentLink2URL: http://www.vishay.com/docs/77678/si7113adn.pdf; Device Class L3: MOSFETs; Device Class L2: Transistors; Footprint Url: https://www.vishay.com/docs/72597/72597.pdf; Digikey Description: MOSFET P-CH 100V 10.8A 1212-8; RoHS: TRUE; Height: 1.17mm; Package: S16-2667-SINGLE; Octopart: https://octopart.com/si7113adn-t1-ge3-vishay-88182558; ComponentLink2Description: Datasheet; Temperature Range High: +150°C; Manufacturer Part Number: SI7113ADN-T1-GE3; Category: Trans; Drain To Source Breakdown Voltage: -100V; Number Of Channels: 1
R16 R17 = CMP-03211-000516-1: as R19 on sheet MAIN; Octopart: https://octopart.com/crgcq0603f1k2-te+connectivity-91018051; ComponentLink2Description: Datasheet; ComponentLink2URL: https://www.te.com/commerce/DocumentDelivery/DDEController?Action=showdoc&DocId=Data+Sheet%7F1773204-3%7F1%7Fpdf%7FEnglish%7FENG_DS_1773204-3_1.pdf%7F4-2176339-710; Category: Res; Temperature: -55°C to +155°C; Temperature Range High: +155°C; Ipc Land Pattern Name: RESC16080X45; Device Class L2: Resistors; Height: 0.55mm; Ambient Temperature Range High: +70°C; RoHS: TRUE; Package: CRGCQ0603; Temperature Range Low: -55°C; Digikey Description: CRGCQ 0603 1K2 1%; Series: CRGCQ; Lead Free: Yes; Manufacturer Part Number: CRGCQ0603F1K2; Device Class L1: Passive Components; Composition: Thick Film; Device Class L3: Chip SMD Resistors
R18 = CMP-13261-004107-1: Res Thick Film 1206 2kΩ 5% 0.25W ±100ppm/°C Molded SMD T/R; Voltage Rating (DC): 200V; Resistance: 2kR; Max Power Dissipation: 250mW; Features: Moisture Resistant; Min Operating Temperature: -55°C; Radiation Hardening: No; Lead Free: Lead Free; Height: 0.026inch; Tolerance: 5%; Case/Package: 1206; Case Code (Metric): 3216; Max Operating Temperature: 155°C; Case Code (Imperial): 1206; Length: 0.126inch; Contact Plating: Tin; Temperature Coefficient: 100ppm/°C; Packaging: Tape and Reel; Depth: 1.6mm; Composition: Thick Film; Number of Terminations: 2; Width: 0.063inch
U1 = CMP-07128-000033-1: IC REG LINEAR 5V 1A DPAK; Max Output Voltage: 5.2V; Dropout Voltage: 2V; Accuracy: 4%; Number of Regulators: 1; Min Input Voltage: 10V; Max Input Voltage: 35V; Output Type: Fixed; Power Supply Rejection Ratio (PSRR): 83dB; Polarity: Positive; Quiescent Current: 3.2mA; Mount: Surface Mount; Number of Pins: 3; Nominal Output Voltage: 5V; Lead Free: Lead Free; Contact Plating: Tin; Packaging: Tape and Reel; Max Output Current: 1A; Width: 6.22mm; Min Operating Temperature: 0°C; Min Output Voltage: 5V; Max Operating Temperature: 125°C; Halogen Free: Halogen Free; Output Current: 1A; Output Voltage: 5V; Case/Package: DPAK; Radiation Hardening: No; Number of Outputs: 1; Height: 2.38mm; Package Quantity: 1; REACH SVHC: No SVHC; Output Voltage Accuracy: 4%; Length: 6.73mm
U2 = CMP-0244-00272-2: IC REG LINEAR POS ADJ 100MA 8SO; Output Voltage: 37V; Number of Regulators: 1; Max Output Current: 200mA; Reference Voltage: 1.3V; Max Input Voltage: 40V; Tolerance: 5%; Min Output Voltage: 1.2V; Output Type: Adjustable; Power Supply Rejection Ratio (PSRR): 80dB; Polarity: Positive; Min Input Voltage: 4.2V; Max Output Voltage: 37V; Height: 1.25mm; Min Operating Temperature: 0°C; Radiation Hardening: No; Output Current: 100mA; Number of Outputs: 1; Case/Package: SO; Number of Pins: 8; Package Quantity: 1; REACH SVHC: No SVHC; Lead Free: Lead Free; Packaging: Tape and Reel; Contact Plating: Tin; Max Operating Temperature: 125°C; Length: 5mm; Mount: Surface Mount; Width: 4mm; Weight: 0.01787oz

## Sheet COMM.SchDoc
size 594 x 420 mm; SheetNumber: 3; SheetTotal: 4
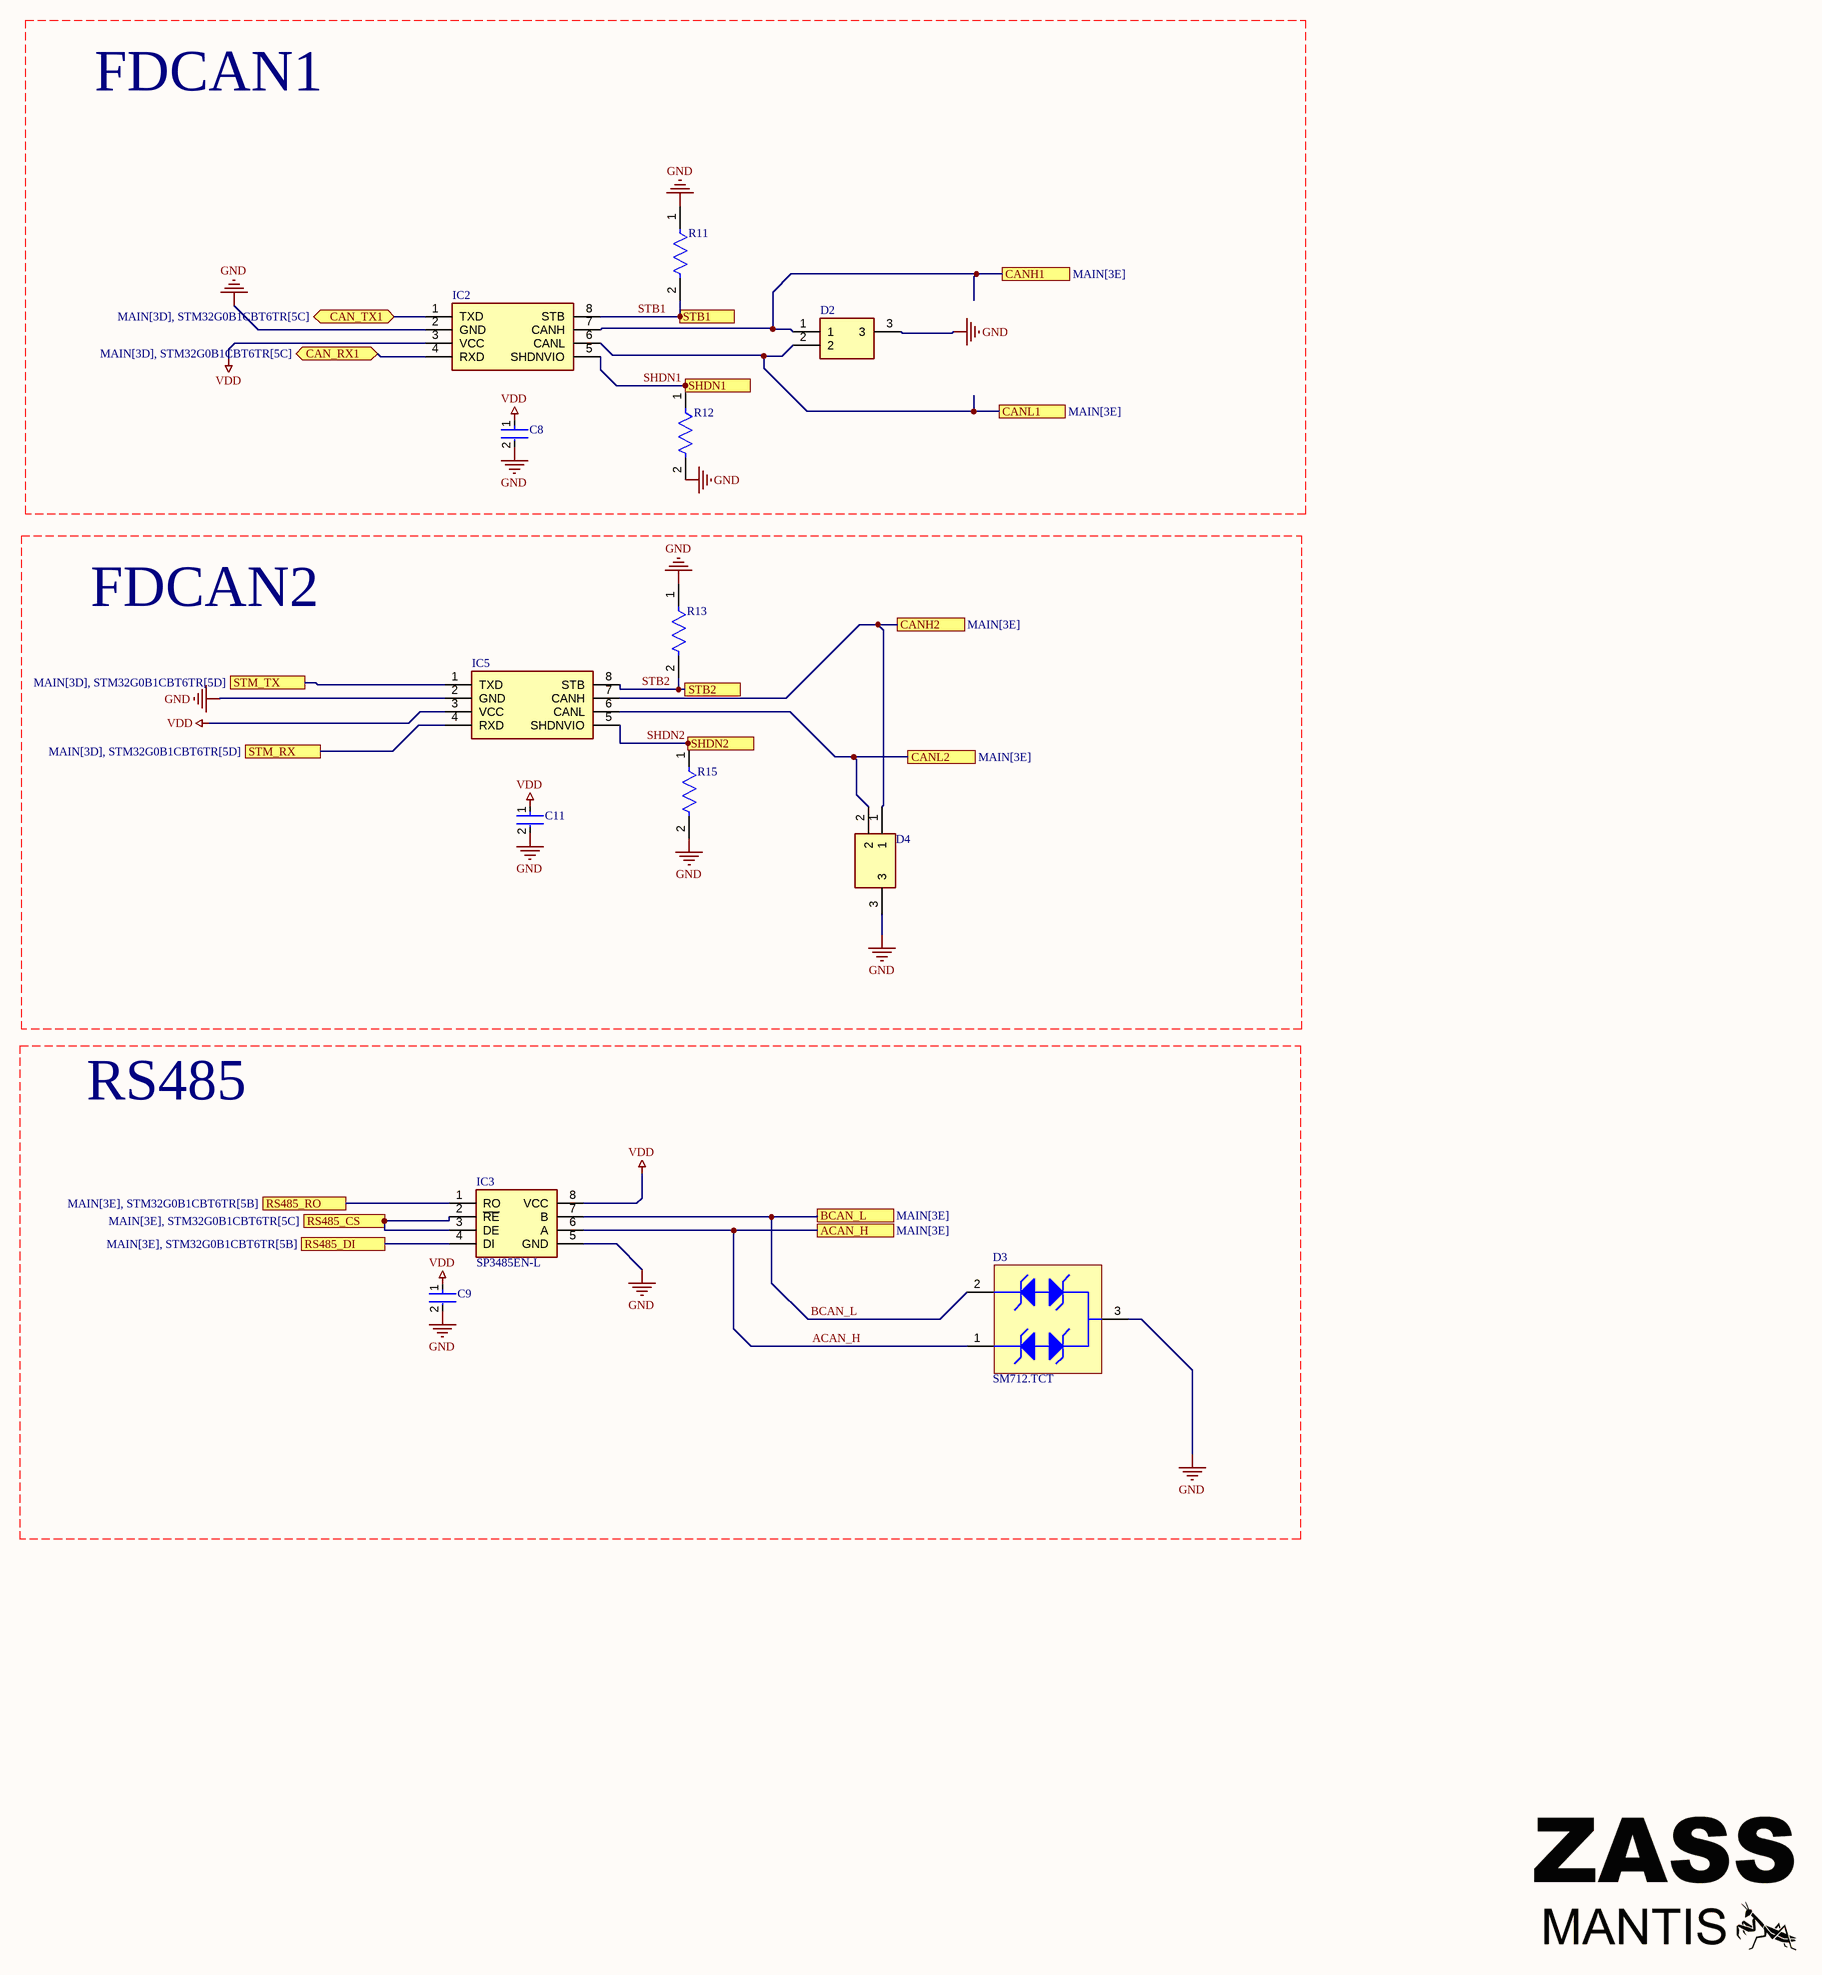
[diagram p4: COMM.SchDoc]

### Parts
C8  CC0805KRX7R5BB104  [FP-CC0805-EA-MFG]  (value not drawn)
C9  CC0805KRX7R5BB104  [FP-CC0805-EA-MFG]  (value not drawn)
C11  CC0805KRX7R5BB104  [FP-CC0805-EA-MFG]  (value not drawn)
D2  ESDCAN06-2BWY  [SOT65P210X110-3N]  (value not drawn)
D3  SM712.TCT  [SMTC-SOT23-3_V]
D4  ESDCAN06-2BWY  [SOT65P210X110-3N]  (value not drawn)
IC2  TCAN3414DR  [SOIC127P600X175-8N]  (value not drawn)
IC3  SP3485EN-L  [SOIC127P600X175-8N]
IC5  TCAN3414DR  [SOIC127P600X175-8N]  (value not drawn)
R11  CRGCQ0603J10K  [FP-CRGCQ0603-IPC_C]  (value not drawn)
R12  CRGCQ0603J10K  [FP-CRGCQ0603-IPC_C]  (value not drawn)
R13  CRGCQ0603J10K  [FP-CRGCQ0603-IPC_C]  (value not drawn)
R15  CRGCQ0603J10K  [FP-CRGCQ0603-IPC_C]  (value not drawn)

### Ports
ACAN_H (see MAIN[3E]), BCAN_L (see MAIN[3E]), CAN_RX1 (bidir, see MAIN[3D], STM32G0B1CBT6TR[5C]), CAN_TX1 (bidir, see MAIN[3D], STM32G0B1CBT6TR[5C]), CANH1 (see MAIN[3E]), CANH2 (see MAIN[3E]), CANL1 (see MAIN[3E]), CANL2 (see MAIN[3E]), RS485_CS (see MAIN[3E], STM32G0B1CBT6TR[5C]), RS485_DI (see MAIN[3E], STM32G0B1CBT6TR[5B]), RS485_RO (see MAIN[3E], STM32G0B1CBT6TR[5B]), SHDN1 (see MAIN[2D], STM32G0B1CBT6TR[5C]), SHDN2 (see MAIN[2D], STM32G0B1CBT6TR[5C]), STB1 (see MAIN[2D], STM32G0B1CBT6TR[5C]), STB2 (see MAIN[2D], STM32G0B1CBT6TR[5C]), STM_RX (see MAIN[3D], STM32G0B1CBT6TR[5D]), STM_TX (see MAIN[3D], STM32G0B1CBT6TR[5D])

### Nets
GND: C8.2 C9.2 C11.2 D2.3 D3.3 D4.3 IC2.2(GND) IC3.5(GND) IC5.2(GND) R11.1 R12.2 R13.1 R15.2
VDD: C8.1 C9.1 C11.1 IC2.3(VCC) IC3.8(VCC) IC5.3(VCC)
ACAN_H: D3.1 IC3.6(A) ; port ACAN_H
BCAN_L: D3.2 IC3.7(B) ; port BCAN_L
SHDN1: IC2.5(SHDNVIO) R12.1 ; port SHDN1
SHDN2: IC5.5(SHDNVIO) R15.1 ; port SHDN2
STB1: IC2.8(STB) R11.2 ; port STB1
STB2: IC5.8(STB) R13.2 ; port STB2
NetD2_1: D2.1 IC2.7(CANH) ; port CANH1
NetD2_2: D2.2 IC2.6(CANL) ; port CANL1
NetD4_1: D4.1 IC5.7(CANH) ; port CANH2
NetD4_2: D4.2 IC5.6(CANL) ; port CANL2
NetIC1_19: IC5.4(RXD) ; port STM_RX
NetIC1_20: IC5.1(TXD) ; port STM_TX
NetIC1_29: IC3.2(~{RE}) IC3.3(DE) ; port RS485_CS
NetIC1_33: IC2.4(RXD) ; port CAN_RX1
NetIC1_34: IC2.1(TXD) ; port CAN_TX1
NetIC1_40: IC3.4(DI) ; port RS485_DI
NetIC1_41: IC3.1(RO) ; port RS485_RO

### Notes on the sheet
- FDCAN1
- FDCAN2
- RS485
- DWG NO:
- REV:
- THIS DOCUMENT AND THE DATA DISCLOSED HEREIN OR
- HEREWITH IS THE PROPERTY OF ALTIUM LIMITED AND MAY
- BE FREELY DISTRIBUTED IN WHOLE. NO RIGHTS ARE
- RESERVED OR EXPRESS OR IMPLIED WARANTEE GIVEN.
- REVISION
- DESCRIPTION
- DATE
- APPROVED
- PROJECT
- PROJECT REVISION:
- TITLE
- A2
- SIZE
- FILE NAME
- SHEET
- OF

### Library data of the parts
C8 C9 C11 = CMP-03422-000810-2: CAP CER X7R 0805; RoHS Compliant: Yes
D2 D4 = ESDCAN06-2BWY: TVS Diode (Bi-directional); Manufacturer_Name: STMicroelectronics; Datasheet Link: https://www.st.com/resource/en/datasheet/esdcan03-2bwy.pdf; Height: 1.1mm; Manufacturer_Part_Number: ESDCAN06-2BWY; Mouser Part Number: 511-ESDCAN06-2BWY; Mouser Price/Stock: https://www.mouser.co.uk/ProductDetail/STMicroelectronics/ESDCAN06-2BWY?qs=u4fy%2FsgLU9P2WkvcJBEfoQ%3D%3D; Arrow Part Number: ESDCAN06-2BWY; Arrow Price/Stock: https://www.arrow.com/en/products/esdcan06-2bwy/stmicroelectronics?utm_currency=USD&region=europe
D3 = CMP-2000-05357-1: Asymmetrical TVS Diode for Extended Common-Mode RS-485, 400 W, -55 to 125 degC, 3-Pin SOT23, RoHS, Tape and Reel; Manufacturer: Semtech; Configuration: Dual; Peak Pulse Power Dissipation: 400W; Product Length (mm): 2.9mm; Working Voltage: 12V/7V; Product Height (mm): 0.95mm; Direction Type: Bi-Directional; Product Depth (mm): 1.3mm; Reverse Breakdown Voltage: 13.3V; Reverse Stand-off Voltage: 12V; Leakage Current (Max): 0.02uA; Number of Elements: 2; Peak Pulse Current: 17A; Leakage Current: 1uA/20uA; Rad Hardened: No; Test Current (It): 1mA; Clamping Voltage: 26V/12V; Datasheet URL: https://datasheet.ciiva.com/18065/getdatasheetpartid-110620-18065348.pdf; Operating Temperature Classification: Military; Operating Temperature Min Deg. C: -55C; Manufacturer URL: http://www.semtech.com/; Package Reference: SOT23-3; Operating Temp Range: -55Cto125C; Mounting Style: SurfaceMount; Polarity: Bi-Directional; Pin Count: 3; Package Description: 3-Pin Small Outline Transistor, Body 2.9 x 1.3 mm, Pitch 0.95 mm; Datasheet Version: Nov-04; Mounting: SurfaceMount; Suppressor Type: TVS; Packaging: TapeandReel; Package / Case: SOT-23; Operating Temperature Max Deg. C: 125C
IC2 IC5 = TCAN3414DR: Integrated Circuit; Manufacturer_Name: Texas Instruments; Datasheet Link: https://www.ti.com/lit/ds/symlink/tcan3414.pdf?ts=1713723144569&ref_url=https%253A%252F%252Fwww.mouser.ch%252F; Height: 1.75mm; Manufacturer_Part_Number: TCAN3414DR; Mouser Part Number: 595-TCAN3414DR; Mouser Price/Stock: https://www.mouser.co.uk/ProductDetail/Texas-Instruments/TCAN3414DR?qs=mELouGlnn3egF2AojRJddw%3D%3D; Arrow Part Number: TCAN3414DR; Arrow Price/Stock: https://www.arrow.com/en/products/tcan3414dr/texas-instruments?utm_currency=USD&region=nac
IC3 = SP3485EN-L: Integrated Circuit; Manufacturer_Name: EXAR; Datasheet Link: https://datasheet.datasheetarchive.com/originals/distributors/Datasheets-DGA14/1190127.pdf; Height: 1.75mm; Manufacturer_Part_Number: SP3485EN-L; Mouser Part Number: 701-SP3485EN-L; Mouser Price/Stock: https://www.mouser.com/Search/Refine.aspx?Keyword=701-SP3485EN-L; Arrow Part Number: SP3485EN-L; Arrow Price/Stock: https://www.arrow.com/en/products/sp3485en-l/exar
R11-R13 R15 = CMP-03211-009884-1: as R1 on sheet MAIN; Composition: Thick Film; ComponentLink2URL: https://www.te.com/commerce/DocumentDelivery/DDEController?Action=showdoc&DocId=Data+Sheet%7F1773204-3%7F1%7Fpdf%7FEnglish%7FENG_DS_1773204-3_1.pdf%7F4-2176339-923; Device Class L1: Passive Components; Package: CRGCQ0603; Mouser Description: Res Thick Film 0603 10K Ohm 5% 0.1W(1/10W) ±100ppm/C Pad SMD Automotive T/R; Temperature Range High: +155°C; Category: Res; Device Class L2: Resistors; Height: 0.55mm; RoHS: TRUE; Lead Free: Yes; Ipc Land Pattern Name: RESC16080X45; Temperature: -55°C to +155°C; Series: CRGCQ; Digikey Description: CRGCQ 0603 10K 5%; Octopart: https://octopart.com/crgcq0603j10k-te+connectivity-91018097; Device Class L3: Chip SMD Resistors; Ambient Temperature Range High: +70°C; ComponentLink2Description: Datasheet; Temperature Range Low: -55°C; Manufacturer Part Number: CRGCQ0603J10K

## Nets that join several sheets
+5: MAIN (P1.4), POWER (C12.1 C14.1 U1.3 U2.1)
GND: MAIN (15 pins), STM32G0B1CBT6TR (13 pins), POWER (7 pins), COMM (13 pins)
VDD: MAIN (10 pins), STM32G0B1CBT6TR (C3.2 C4.2 IC1.5 IC1.6), POWER (6 pins), COMM (6 pins)
ACAN_H: MAIN (J4.3 R28.1), COMM (D3.1 IC3.6)
BCAN_L: MAIN (J4.2 R28.2), COMM (D3.2 IC3.7)
INPUT: MAIN (D5.1 J1.1 J5.2), POWER (Q2.5-6-7-8)
NetD2_1: MAIN (J3.2 R2.1), COMM (D2.1 IC2.7)
NetD2_2: MAIN (J3.1 R2.2), COMM (D2.2 IC2.6)
NetD4_1: MAIN (J9.2 R27.1), COMM (D4.1 IC5.7)
NetD4_2: MAIN (J9.1 R27.2), COMM (D4.2 IC5.6)
NetIC1_12: MAIN (J6.3 R3.1), STM32G0B1CBT6TR (IC1.12)
NetIC1_13: MAIN (J6.5 R1.1), STM32G0B1CBT6TR (IC1.13)
NetIC1_14: MAIN (J7.CD1 R14.1), STM32G0B1CBT6TR (IC1.14)
NetIC1_19: STM32G0B1CBT6TR (IC1.19), COMM (IC5.4)
NetIC1_20: STM32G0B1CBT6TR (IC1.20), COMM (IC5.1)
NetIC1_22: MAIN (P1.1), STM32G0B1CBT6TR (IC1.22)
NetIC1_23: MAIN (P1.2), STM32G0B1CBT6TR (IC1.23)
NetIC1_29: STM32G0B1CBT6TR (IC1.29), COMM (IC3.2 IC3.3)
NetIC1_32: MAIN (R19.1), STM32G0B1CBT6TR (IC1.32)
NetIC1_33: STM32G0B1CBT6TR (IC1.33), COMM (IC2.4)
NetIC1_34: STM32G0B1CBT6TR (IC1.34), COMM (IC2.1)
NetIC1_40: STM32G0B1CBT6TR (IC1.40), COMM (IC3.4)
NetIC1_41: STM32G0B1CBT6TR (IC1.41), COMM (IC3.1)
NetIC1_47: MAIN (J8.2), STM32G0B1CBT6TR (IC1.47)
NetIC1_48: MAIN (J8.3), STM32G0B1CBT6TR (IC1.48)
NRST: MAIN (J2.5 J6.1 R4.1), STM32G0B1CBT6TR (5 pins)
SD_CS: MAIN (J7.2 R9.1), STM32G0B1CBT6TR (IC1.15)
SD_MISO: MAIN (J7.7 R6.1), STM32G0B1CBT6TR (IC1.17)
SD_MOSI: MAIN (J7.3 R8.1), STM32G0B1CBT6TR (IC1.18)
SD_SCK: MAIN (J7.5 R7.1), STM32G0B1CBT6TR (IC1.16)
SHDN1: STM32G0B1CBT6TR (IC1.27), COMM (IC2.5 R12.1)
SHDN2: STM32G0B1CBT6TR (IC1.25), COMM (IC5.5 R15.1)
STB1: STM32G0B1CBT6TR (IC1.28), COMM (IC2.8 R11.2)
STB2: STM32G0B1CBT6TR (IC1.26), COMM (IC5.8 R13.2)
SWCLK: MAIN (J2.3), STM32G0B1CBT6TR (IC1.36)
SWDIO: MAIN (J2.4), STM32G0B1CBT6TR (IC1.35)